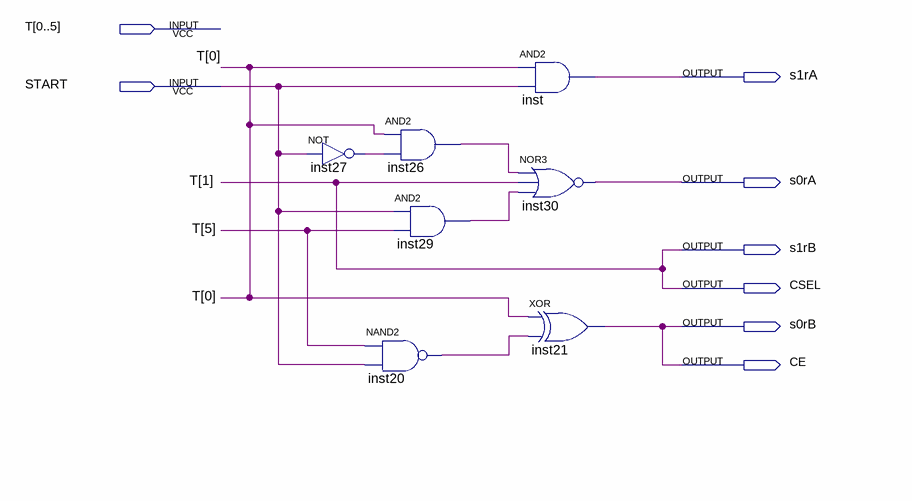
[diagram p0: schematic sheet]
// Quartus schematic control_cir.bdf as structural Verilog: 7 symbols, 8 pins
module control_cir (
  input  [0:5] T,
  input  START,
  output s1rA,
  output s0rA,
  output s1rB,
  output CSEL,
  output s0rB,
  output CE
);

  wire inst20_out, inst26_out, inst27_out, inst29_out;

  not inst27 (inst27_out, START);
  nand inst20 (inst20_out, T[5], START);
  and inst26 (inst26_out, T[0], inst27_out);
  and inst29 (inst29_out, START, T[5]);
  and inst (s1rA, T[0], START);
  nor inst30 (s0rA, inst26_out, T[1], inst29_out);
  xor inst21 (CE, T[0], inst20_out);

  assign CSEL = T[1];
  assign s0rB = CE;
  assign s1rB = T[1];
endmodule
